# EAGLE design KidSize (EAGLE 9.6.2)
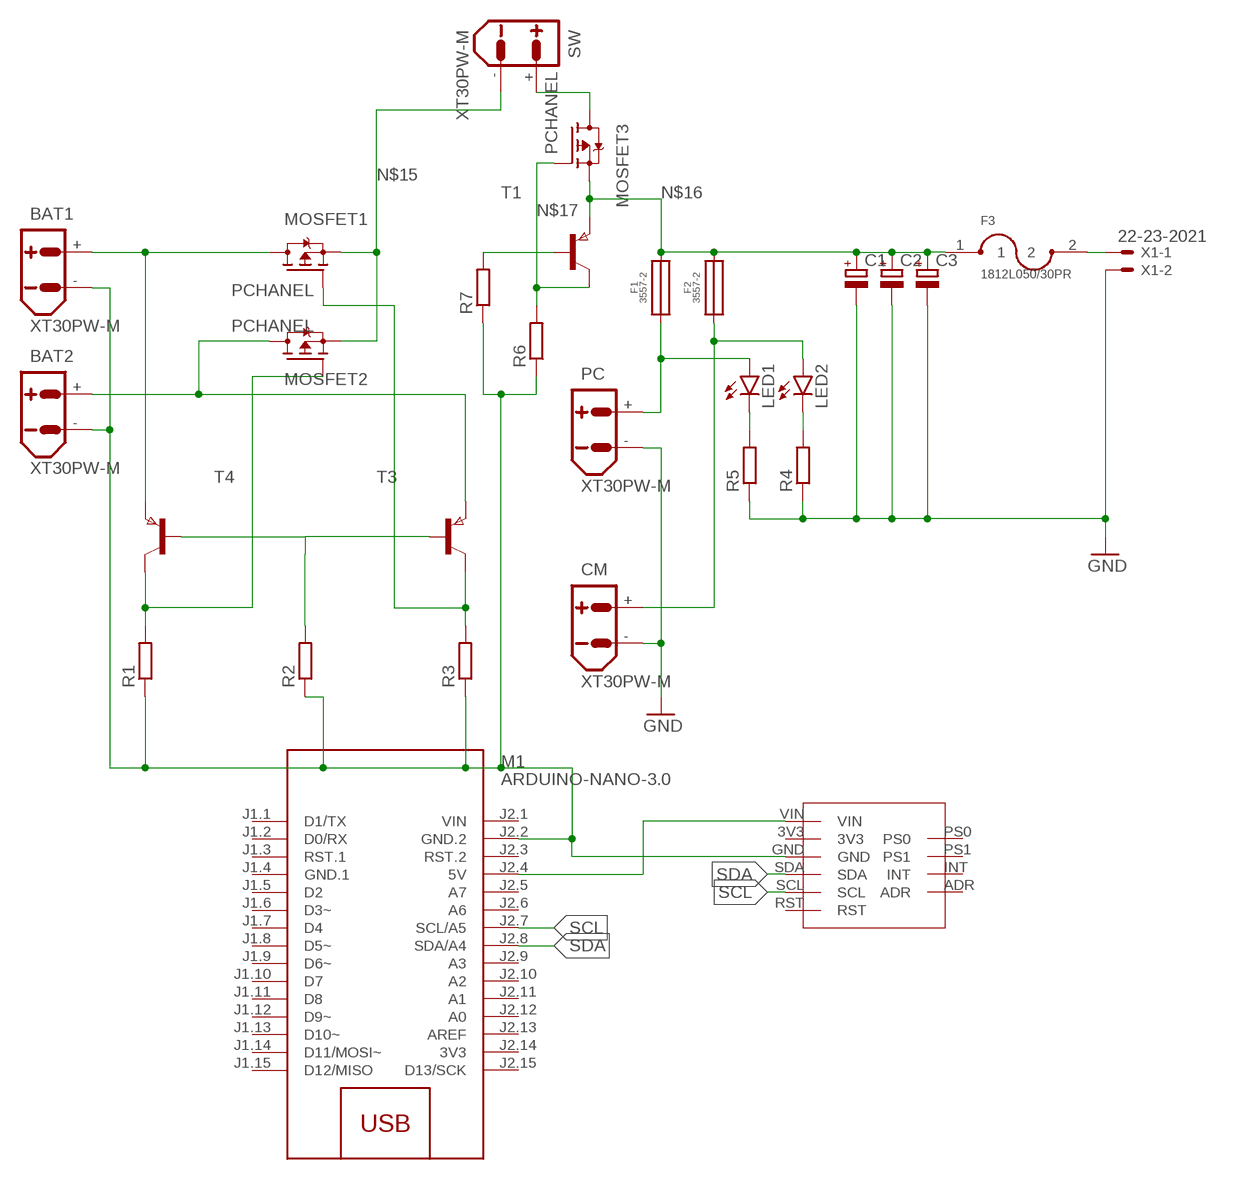
[diagram p0: schematic, sheet 1]

## Parts
BAT1  XT30PW-M  [XT30PW-M]
BAT2  XT30PW-M  [XT30PW-M]
C1  CPOL-EU150CLZ-1014  [150CLZ-1014]
C2  CPOL-EU150CLZ-1014  [150CLZ-1014]
C3  CPOL-EU150CLZ-1014  [150CLZ-1014]
CM  XT30PW-M  [XT30PW-M]
F1  3557-2  [3557-2]
F2  3557-2  [3557-2]
F3  1812L050/30PR  [FUSM4632X75]
LED1  LEDCHIP-LED0805  [CHIP-LED0805]
LED2  LEDCHIP-LED0805  [CHIP-LED0805]
M1  ARDUINO-NANO-3.0  [ARDUINO-NANO-3.0]
MOSFET1  PCHANEL  FDD4141TO252  [TO252]
MOSFET2  PCHANEL  FDD4141TO252  [TO252]
MOSFET3  PCHANEL  FDD4141TO252  [TO252]
PC  XT30PW-M  [XT30PW-M]
R1  R-EU_R1206  [R1206]
R2  R-EU_R1206  [R1206]
R3  R-EU_R1206  [R1206]
R4  R-EU_M0805  [M0805]
R5  R-EU_M0805  [M0805]
R6  R-EU_M0805  [M0805]
R7  R-EU_M0805  [M0805]
SW  XT30PW-M  [XT30PW-M]
T1  PNPSOT23  [SOT-23]
T3  PNPSOT23  [SOT-23]
T4  PNPSOT23  [SOT-23]
U$1  BNO055_BNO055  [BNO055_BNO055]
X1  22-23-2021  [22-23-2021]

## Nets
GND: BAT1.- BAT2.- C1.- C2.- C3.- CM.- M1.J2.2(GND.2) PC.- R1.1 R2.1 R3.1 R4.1 R5.1 R6.1 R7.1 U$1.GND X1.2
N$1: BAT1.+ MOSFET1.3(D) T4.2(E)
N$2: MOSFET2.1(G) R1.2 T4.1(C)
N$3: R2.2 T3.3(B) T4.3(B)
N$4: M1.J2.4(5V) U$1.VIN
N$6: F1.1 F1.2 LED1.A PC.+
N$7: CM.+ F2.1 F2.2 LED2.A
N$8: R7.2 T1.3(B)
N$9: MOSFET1.1(G) R3.2 T3.1(C)
N$10: BAT2.+ MOSFET2.3(D) T3.2(E)
N$11: LED1.C R5.2
N$12: MOSFET3.3(D) SW.+
N$13: LED2.C R4.2
N$14: F3.2 X1.1
N$15: MOSFET1.2(S) MOSFET2.2(S) SW.-
N$16: C1.+ C2.+ C3.+ F1.3 F1.4 F2.3 F2.4 F3.1 MOSFET3.2(S) T1.2(E)
N$17: MOSFET3.1(G) R6.2 T1.1(C)
SCL: M1.J2.7(SCL/A5) U$1.SCL
SDA: M1.J2.8(SDA/A4) U$1.SDA
Unconnected: M1.J1.1(D1/TX) M1.J1.2(D0/RX) M1.J1.3(RST.1) M1.J1.5(D2) M1.J1.6(D3~) M1.J1.7(D4) M1.J1.8(D5~) M1.J1.9(D6~) M1.J1.10(D7) M1.J1.11(D8) M1.J1.12(D9~) M1.J1.13(D10~) M1.J1.14(D11/MOSI~) M1.J1.15(D12/MISO) M1.J2.3(RST.2) M1.J2.5(A7) M1.J2.6(A6) M1.J2.9(A3) M1.J2.10(A2) M1.J2.11(A1) M1.J2.12(A0) M1.J2.13(AREF) M1.J2.15(D13/SCK) U$1.3V3 U$1.ADR U$1.INT U$1.PS0 U$1.PS1 U$1.RST

## Power pins joined to a net without a drawn wire
3V3: M1.J2.14(3V3)
GND.1: M1.J1.4(GND.1)
VIN: M1.J2.1(VIN)

## Library data of the parts
BAT1 BAT2 CM PC SW = amass:XT30: AMASS XT30 connector Store in Japan AMASS XT30 connector <https://szc.jp/ams-xt30>
C1-C3 = resistor12:CPOL-EU: POLARIZED CAPACITOR, European symbol
F1 F2 = 3557-2:3557-2
F3 = 1812L050_30PR:1812L050/30PR: PTC Resettable Fuse 0.5A(hold) 1A(trip) 15VDC 100A 0.8W 0.15s 0.15Ohm SMD Solder Pad 1812 T/R Check availability <https://pricing.snapeda.com/parts/1812L050/30PR/Littelfuse/view-part?ref=eda>; AVAILABILITY: In Stock; CHECK_PRICES: https://www.snapeda.com/parts/1812L050/30PR/Ersa/view-part/?ref=eda; DESCRIPTION: Fuse, Resettable, 1812 Series, PPTC 30V, 500mA, Surface Mount | Littelfuse 1812L050/30PR; MF: Littelfuse; MP: 1812L050/30PR; PACKAGE: None; PRICE: None; PURCHASE-URL: https://www.snapeda.com/api/url_track_click_mouser/?unipart_id=12295976&manufacturer=Littelfuse&part_name=1812L050/30PR&search_term=fuse pptc; SNAPEDA_LINK: https://www.snapeda.com/parts/1812L050/30PR/Ersa/view-part/?ref=snap
LED1 LED2 = led:LED: LED OSRAM: - CHIPLED LG R971, LG N971, LY N971, LG Q971, LY Q971, LO R971, LY R971 LH N974, LH R974 LS Q976, LO Q976, LY Q976 LO Q996 - Hyper CHIPLED LW Q18S LB Q993, LB Q99A, LB R99A - SideLED LS A670, LO A670, LY A670, LG A670, LP A670 LB A673, LV A673, LT A673, LW A673 LH A674 LY A675 LS A676, LA A676, LO A676, LY A676, LW A676 LS A679, LY A679, LG A679 - Hyper Micro SIDELED® LS Y876, LA Y876, LO Y876, LY Y876 LT Y87S - SmartLED LW L88C, LW L88S LB L89C, LB L89S, LG L890 LS L89K, LO L89K, LY L89K LS L896, LA L896, LO L896, LY L896 - TOPLED LS T670, LO T670, LY T670, LG T670, LP T670 LSG T670, LSP T670, LSY T670, LOP T670, LYG T670 LG T671, LOG T671, LSG T671 LB T673, LV T673, LT T673, LW T673 LH T674 LS T676, LA T676, LO T676, LY T676, LB T676, LH T676, LSB T676, LW T676 LB T67C, LV T67C, LT T67C, LS T67K, LO T67K, LY T67K, LW E67C LS E67B, LA E67B, LO E67B, LY E67B, LB E67C, LV E67C, LT E67C LW T67C LS T679, LY T679, LG T679 LS T770, LO T770, LY T770, LG T770, LP T770 LB T773, LV T773, LT T773, LW T773 LH T774 LS E675, LA E675, LY E675, LS T675 LS T776, LA T776, LO T776, LY T776, LB T776 LHGB T686 LT T68C, LB T68C - Hyper Mini TOPLED® LB M676 - Mini TOPLED Santana® LG M470 LS M47K, LO M47K, LY M47K Source: http://www.osram.convergy.de LUXEON: - LUMILED® LXK2-PW12-R00, LXK2-PW12-S00, LXK2-PW14-U00, LXK2-PW14-V00 LXK2-PM12-R00, LXK2-PM12-S00, LXK2-PM14-U00 LXK2-PE12-Q00, LXK2-PE12-R00, LXK2-PE12-S00, LXK2-PE14-T00, LXK2-PE14-U00 LXK2-PB12-K00, LXK2-PB12-L00, LXK2-PB12-M00, LXK2-PB14-N00, LXK2-PB14-P00, LXK2-PB14-Q00 LXK2-PR12-L00, LXK2-PR12-M00, LXK2-PR14-Q00, LXK2-PR14-R00 LXK2-PD12-Q00, LXK2-PD12-R00, LXK2-PD12-S00 LXK2-PH12-R00, LXK2-PH12-S00 LXK2-PL12-P00, LXK2-PL12-Q00, LXK2-PL12-R00 Source: www.luxeon.com KINGBRIGHT: KA-3528ASYC Source: www.kingbright.com
M1 = diy-modules:ARDUINO-NANO-3.0: Arduino Nano 3.0 and compatible devices More details available here: https://www.arduino.cc/en/Main/ArduinoBoardNano Click here to find device on ebay.com <http://www.ebay.com/sch/arduino+nano>
MOSFET1-MOSFET3 = transistor-fet:FDD4141: P-Channel PowerTrench® MOSFET Source: FDD4141.pdf
R1-R7 = rcl:R-EU_: RESISTOR, European symbol; SPICEPREFIX: R
T1 T3 T4 = zetex:PNPSOT23: PNP TRANSISTOR; MPN: DSS20200L-7; OC_FARNELL: unknown; OC_NEWARK: 25R4554
U$1 = CM FT4232 with RS485 and ESP32:BNO055_BNO055
X1 = con-molex:22-23-2021: .100" (2.54mm) Center Header - 2 Pin; MF: MOLEX; MPN: 22-23-2021; OC_FARNELL: 1462926; OC_NEWARK: 25C3832

## Board
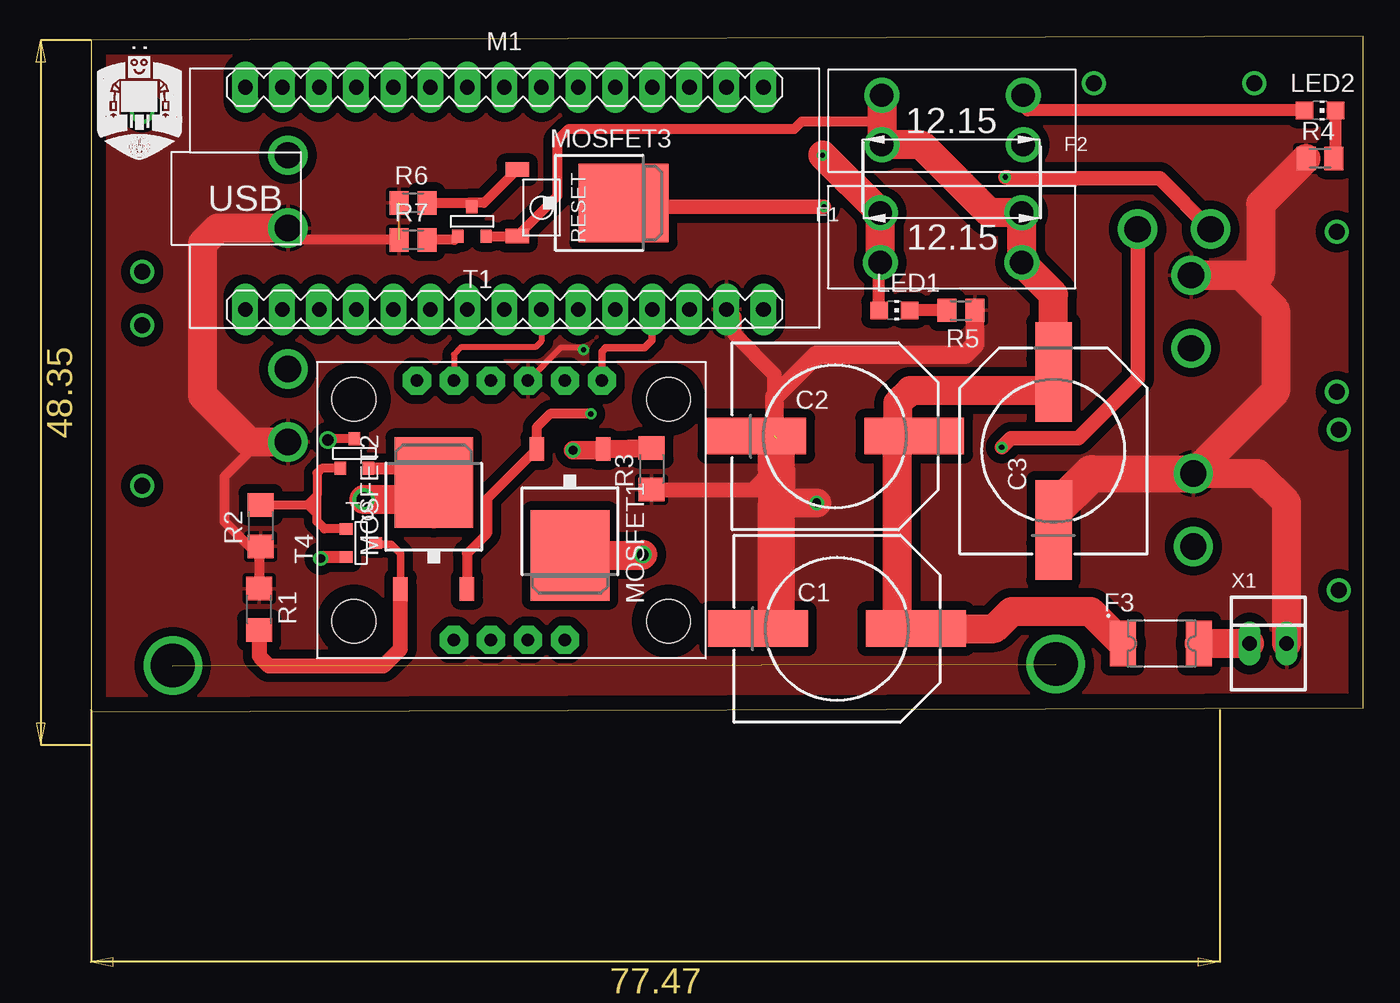
[diagram p1: board, top side]
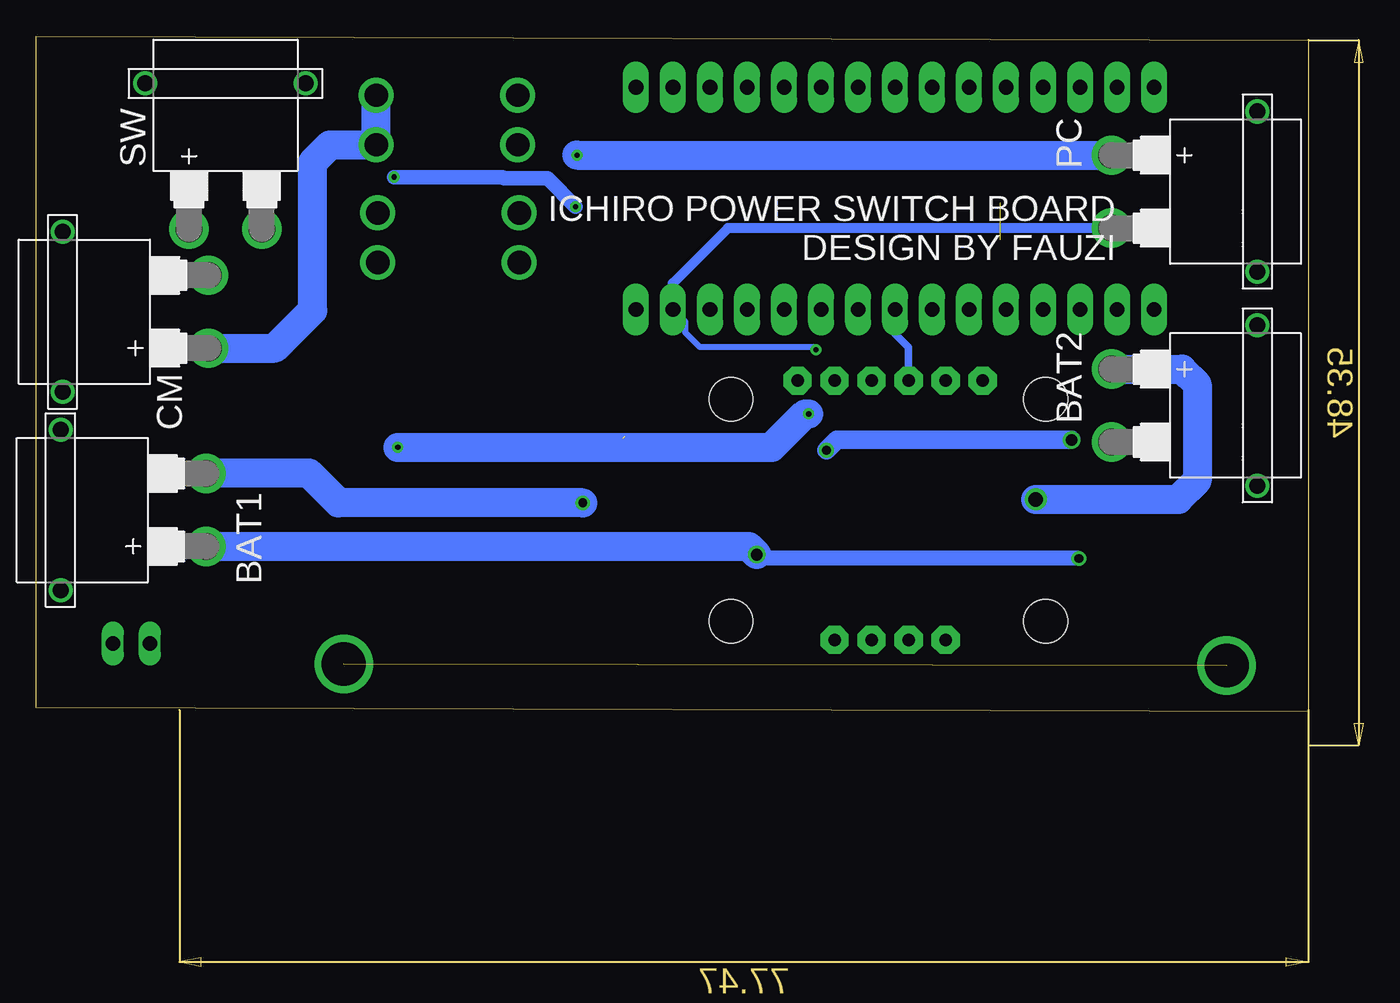
[diagram p2: board, bottom side, seen from below]

Size 87.28 x 46.32 mm. Coordinates in mm from the lower left corner, seen from the top.
Outline: 0,0 87.28,0.25 87.28,46.32 0,46.07 0,0
Copper layers (1*16): Top 0.035mm / dielectric 1.5mm / Bottom 0.035mm
Design rules "default *": minimum track width 6mil, minimum drill 0.35mm, track to track 24mil, track to pad 24mil, pad to pad 24mil, via to via 24mil, smd to smd 24mil, copper to edge 40mil, drill to drill 6mil, minimum pad ring 10mil, minimum via ring 8mil, stop-mask expansion 4mil, vias tented up to drill 0mil, thermal gap 10mil

### Footprints (pad centres in the part's own frame; a part is rotated, then mirrored left to right if it is on the bottom)
XT30PW-M = drill 1.8: + -2.5,0; - 2.5,0 | drill 1.1: P$3 -5.5,10; P$4 5.5,10
150CLZ-1014 = smd 4.3 x 2.5: + 4.15,0; +1 6.69,0; - -4.15,0; -1 -4.15,0; -2 -6.69,0
3557-2 = drill 1.6: 1 3.603,5.154; 2 3.603,1.754; 3 13.311,5.154; 4 13.311,1.754
FUSM4632X75 = smd 1.78 x 3.15: 1 -2.615,0; 2 2.615,0
CHIP-LED0805 = smd 1.2 x 1.2: A 0,-1.05; C 0,1.05
ARDUINO-NANO-3.0 = drill 1 pad 1.778 long: J1.1 17.78,7.62; J1.2 15.24,7.62; J1.3 12.7,7.62; J1.4 10.16,7.62; J1.5 7.62,7.62; J1.6 5.08,7.62; J1.7 2.54,7.62; J1.8 0,7.62; J1.9 -2.54,7.62; J1.10 -5.08,7.62; J1.11 -7.62,7.62; J1.12 -10.16,7.62; J1.13 -12.7,7.62; J1.14 -15.24,7.62; J1.15 -17.78,7.62; J2.1 17.78,-7.62; J2.2 15.24,-7.62; J2.3 12.7,-7.62; J2.4 10.16,-7.62; J2.5 7.62,-7.62; J2.6 5.08,-7.62; J2.7 2.54,-7.62; J2.8 0,-7.62; J2.9 -2.54,-7.62; J2.10 -5.08,-7.62; J2.11 -7.62,-7.62; J2.12 -10.16,-7.62; J2.13 -12.7,-7.62; J2.14 -15.24,-7.62; J2.15 -17.78,-7.62
TO252 = smd 1 x 1.6: 1 -2.28,-4.8; 2 2.28,-4.8 | smd 5.4 x 6.2: 3 0,2.5
R1206 = smd 1.6 x 1.803: 1 -1.422,0; 2 1.422,0
M0805 = smd 1.3 x 1.6: 1 -0.95,0; 2 0.95,0
SOT-23 = smd 0.787 x 0.889: 1 0.025,-1.016; 2 -0.94,1.016; 3 0.991,1.016
BNO055_BNO055 = drill 0.85 pad 1.93 octagon: 3V3 9.652,1.27; ADR 17.272,19.05; GND 12.192,1.27; INT 14.732,19.05; PS0 9.652,19.05; PS1 12.192,19.05; RST 19.812,1.27; SCL 17.272,1.27; SDA 14.732,1.27; VIN 7.112,1.27 | hole 3: 2.54,2.54; 2.54,17.78; 24.13,2.54; 24.13,17.78
22-23-2021 = drill 1 long: 1 -1.27,0; 2 1.27,0

### Placement (x,y rotation side)
BAT1  75.63,13.83 90 bottom
BAT2  13.5,21 270 bottom
C1  51.19,5.69 0 top
C2  51.05,18.9 0 top
C3  66.04,17.88 90 top
CM  75.49,27.43 90 bottom
F1  50.55,29.06 0 top
F2  67.56,44.04 180 top
F3  73.41,4.67 0 top
LED1  55.12,27.54 270 top
LED2  84.33,41.25 270 top
M1  28.36,35.22 0 top
MOSFET1  32.86,13.22 180 top
MOSFET2  23.51,13.22 0 top
MOSFET3  34.04,34.9 270 top
PC  13.5,35.67 270 bottom
R1  11.54,7.02 270 top
R2  11.64,12.76 90 top
R3  38.46,16.66 90 top
R4  84.33,37.95 0 top
R5  59.69,27.54 180 top
R6  22.1,34.9 0 top
R7  22.1,32.36 0 top
SW  74.32,33.1 0 bottom
T1  26.16,33.63 180 top
T3  18.08,17.71 180 top
T4  18.51,11.55 90 top
U$1  42.16,23.98 180 top
X1  80.77,4.67 0 top

### Tracks (layer width: path | path; a pad name or v marks a point on that pad's centre or on a via)
GND  (via drill 0.35, 0.6)  (2 unrouted)
  Top 0.4: U$1.GND 32.26,24.99 33.78,24.99 v33.78,24.83
  Top 0.7: 11.56,8.42 R1.1 11.54,11.24 R2.1 10.86,11.34 9.14,13.06 9.14,16.1 11.54,18.5 13.46,18.5 BAT2.- | R7.1 14.31,32.36 PC.-
  Top 1: M1.J2.2 44.14,27.06 44.14,25.88 46.9,23.12 46.9,21.26
  Top 1.016: R1.1 11.38,8.59 | R3.1 45.41,15.24 | 45.41,15.24 46.7,16.53 47.04,16.53 | 45.41,15.24 46.12,15.24 47.04,14.33
  Top 1.27: R5.1 60.64,25.18 59.94,24.49 49.78,24.49 46.9,21.61 46.9,21.26 C2.-
  Top 2: 47.04,14.33 v49.78,14.33 | X1.2 82.04,14.33 80.03,16.34 BAT1.- 81.28,21.98 81.28,27.54 78.88,29.94 CM.- 80.12,29.94 80.26,30.07 80.26,34.84 R4.1 | PC.- 8.69,33.17 7.62,32.11 7.62,21.69 10.81,18.5 13.46,18.5
  Top 2.54: 47.04,18.77 47.04,16.53 47.04,14.33 C1.- | C3.- 68.64,16.34 BAT1.-
  Bottom 0.4: v33.78,24.83 33.96,25.01 41.76,25.01 42.76,26 42.76,26.76 M1.J2.2
  Bottom 0.7: PC.- 39.83,33.17 43.6,29.4 M1.J2.2
  Bottom 2: v49.78,14.33 66.55,14.33 68.58,16.36 75.61,16.36 BAT1.-
  pour Top: 87.12,46.08 87.12,0.1 0,0.1 0,46.08
N$1  (via drill 0.6, 0.8)
  Top 0.813: T4.2 15.84,10.61 v15.75,10.52
  Top 1.016: MOSFET1.3 33.1,10.96 33.1,12.27 34.41,10.96 34.41,9.77 | MOSFET1.3 32.3,11.28 32.3,12.17 31.3,12.17 31.11,11.97 31.11,9.56 | 32.86,8.9 32.86,10.01 MOSFET1.3
  Top 1.27: 32.86,10.55 32.86,10.01
  Top 2: MOSFET1.3 33.61,9.97 | MOSFET1.3 32.91,10.77 | MOSFET1.3 37.79,10.72 v37.85,10.77
  Bottom 1.016: v15.75,10.52 37.59,10.52 v37.85,10.77
  Bottom 2: BAT1.+ 38.41,11.34 v37.85,10.77
N$2
  Top 0.508: 21.23,8.57 21.23,10.84 20.57,11.5 19.6,11.5 T4.1
  Top 0.61: 21.23,8.57 21.18,8.51
  Top 0.813: MOSFET2.1 21.23,8.57
  Top 1.016: R1.2 11.54,3.81 12.19,3.15 20.07,3.15 21.23,4.31 21.23,8.57
N$3
  Top 0.508: 11.75,14.07 R2.2
  Top 0.61: T3.3 15.83,16.7 15.49,16.36 15.49,14.84 | R2.2 14.84,14.19 | 15.49,14.84 14.84,14.19 | T4.3 16.01,12.54 15.49,13.06 15.49,13.54 | 15.49,13.54 15.49,13.82 | 15.49,13.82 15.49,14.84 | 14.84,14.19 15.13,14.19 15.49,13.82 | 14.84,14.19 15.49,13.54
N$4
  Top 0.508: M1.J2.4 38.49,27.57 38.49,25.47 37.98,24.95 35.31,24.95 35.05,24.7 U$1.VIN
N$5  (via drill 3)  (1 unrouted)
  other vias: 66.2,3.27 5.6,3.17
N$6  (via drill 0.35)
  Top 0.813: LED1.A 54.07,30.73 F1.2
  Top 2: F1.2 F1.1 v50.19,38.17
  Bottom 2: v50.19,38.17 PC.+
N$7
  Top 0.813: LED2.A 64.26,41.25 63.96,41.55 F2.2
  Bottom 2: CM.+ 70.93,24.94 68.33,27.54 68.33,37.7 67.13,38.89 F2.1 F2.2
N$8
  Top 0.7: T1.3 24.92,32.36 R7.2
N$9  (via drill 0.6, 0.8)
  Top 0.61: T3.1 16.34,18.73 v16.26,18.65
  Top 0.813: MOSFET1.1
  Top 1.27: R3.2 35.17,17.99 MOSFET1.1 35.06,17.94 v33.07,17.94
  Bottom 1.27: v33.07,17.94 32.36,18.65 v16.26,18.65
N$10  (via drill 1)
  Top 0.61: 21.46,17.71 21.5,17.67
  Top 0.813: T3.2 20.96,16.7 23.1,14.56
  Top 1.016: 23.51,13.07 23.51,14.84 MOSFET2.3 21.52,17.71 21.46,17.71
  Top 2: v18.71,14.56 23.1,14.56 24.13,15.6 24.13,16.1 23.88,16.36 23.51,15.99 23.51,14.84
  Bottom 2: BAT2.+ 8.67,23.5 7.62,22.45 7.62,15.85 8.91,14.56 v18.71,14.56
N$11
  Top 0.813: R5.2 LED1.C
N$12  (via drill 0.35)
  Top 1: SW.+ 73.34,36.58 63.01,36.58 62.91,36.68 v62.74,36.68 | v50.29,34.65 36.79,34.65 MOSFET3.3
  Bottom 1: v62.74,36.68 55.31,36.68 55.21,36.58 52.23,36.58 v50.29,34.65
N$13
  Top 0.813: LED2.C 85.38,38.05 R4.2
N$14
  Top 2: X1.1 F3.2
N$15  (via drill 0.35)
  Top 0.7: MOSFET2.2 25.79,10.84 27.17,12.22 27.17,14.61 MOSFET1.2 30.58,19.51 31.5,20.42 v34.29,20.42
  Top 1: v62.48,18.14 63.12,18.77 67.75,18.77 71.81,22.84 SW.-
  Bottom 2: v62.48,18.14 36.83,18.14 34.54,20.42 v34.29,20.42
N$16
  Top 0.7: T1.2 MOSFET3.2 32,35.39 32,39.22 32.77,39.98 48.26,39.98 48.77,40.49 54.25,40.49
  Top 1.016: 63.6,30.56 F1.4
  Top 2: F2.4 54.25,40.49 F2.3 56.97,38.89 61.65,34.21 F1.3 F1.4 66.04,28.63 C3.+ 56.22,22.03 55.34,21.15 55.34,18.77 | 55.34,18.77 C1.+ 61.98,5.69 63.17,6.88 68.58,6.88 F3.1 | 55.34,18.77 C2.+
N$17
  Top 0.7: R6.2 25.88,34.9 | 25.88,34.9 T1.1 | MOSFET3.1 26.96,34.9 25.88,34.9
SCL
  Top 0.406: M1.J2.7 30.9,25.41 30.49,25.01 25.4,25.01 24.89,24.5 U$1.SCL
SDA
  Bottom 0.508: U$1.SDA 27.43,24.99 28.36,25.92 M1.J2.8

### Text on the board
tPlace: D:/Ichiro/logopcb.bmp
bNames: ICHIRO POWER SWITCH BOARD / DESIGN BY FAUZI